# Altium project Soldering_Station_Power_Board.PrjPcb
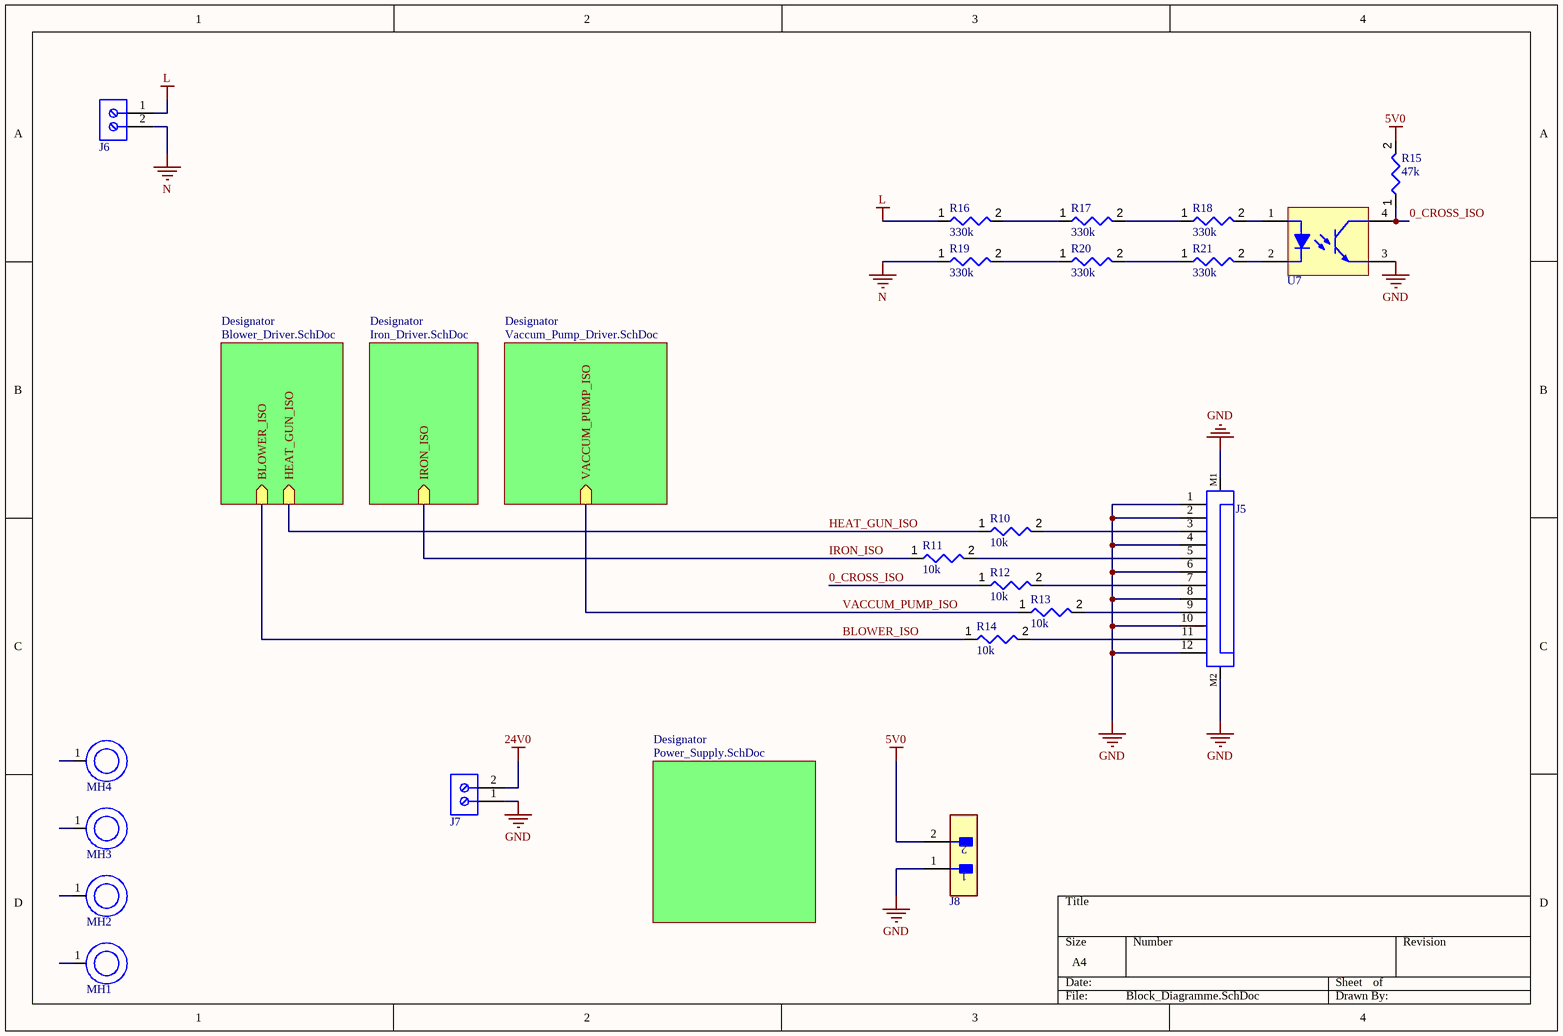
[diagram p0: Block_Diagramme.SchDoc]
5 sheets, 70 parts. Net scope: hierarchical (ports join the sheet entries above them; power ports are global).
Board file: PCB.PcbDoc
Sheets:
  Block_Diagramme.SchDoc
    Designator = Blower_Driver.SchDoc
    Designator = Iron_Driver.SchDoc
    Designator = Vaccum_Pump_Driver.SchDoc
    Designator = Power_Supply.SchDoc

## Sheet Block_Diagramme.SchDoc
size A4; SheetNumber: 1; SheetTotal: 5

### Parts
J5  687112183622  [687112183622]  (value not drawn)
J6  691137710002  [691137710002]  (value not drawn)
J7  691137710002  [691137710002]  (value not drawn)
J8  B2B-XH-A(LF)(SN)  [FP-B2B-XH-A_LF_SN-MFG]  (value not drawn)
MH1  3mm_Mounting_Hole  [Single_3mm_Mounting_Hole]  (value not drawn)
MH2  3mm_Mounting_Hole  [Single_3mm_Mounting_Hole]  (value not drawn)
MH3  3mm_Mounting_Hole  [Single_3mm_Mounting_Hole]  (value not drawn)
MH4  3mm_Mounting_Hole  [Single_3mm_Mounting_Hole]  (value not drawn)
R10  value 10k  [Generic_0603_RES]  (hidden comment: RES-TK_SMD-0603_VIS-CRCW_K_10K_1/10W_1%)
R11  value 10k  [Generic_0603_RES]  (hidden comment: RES-TK_SMD-0603_VIS-CRCW_K_10K_1/10W_1%)
R12  value 10k  [Generic_0603_RES]  (hidden comment: RES-TK_SMD-0603_VIS-CRCW_K_10K_1/10W_1%)
R13  value 10k  [Generic_0603_RES]  (hidden comment: RES-TK_SMD-0603_VIS-CRCW_K_10K_1/10W_1%)
R14  value 10k  [Generic_0603_RES]  (hidden comment: RES-TK_SMD-0603_VIS-CRCW_K_10K_1/10W_1%)
R15  value 47k  [Generic_0603_RES]  (hidden comment: RES-TK_SMD-0603_VIS-CRCW_K_47K_1/10W_1%)
R16  value 330k  [Generic_1206_RES]  (hidden comment: RES-TK_SMD-1206_VIS-CRCW_K_330K_1/4W_1%)
R17  value 330k  [Generic_1206_RES]  (hidden comment: RES-TK_SMD-1206_VIS-CRCW_K_330K_1/4W_1%)
R18  value 330k  [Generic_1206_RES]  (hidden comment: RES-TK_SMD-1206_VIS-CRCW_K_330K_1/4W_1%)
R19  value 330k  [Generic_1206_RES]  (hidden comment: RES-TK_SMD-1206_VIS-CRCW_K_330K_1/4W_1%)
R20  value 330k  [Generic_1206_RES]  (hidden comment: RES-TK_SMD-1206_VIS-CRCW_K_330K_1/4W_1%)
R21  value 330k  [Generic_1206_RES]  (hidden comment: RES-TK_SMD-1206_VIS-CRCW_K_330K_1/4W_1%)
U7  H11A817ASD  [FAIR-H11A817ASD-4_V]  (value not drawn)

### Sub-sheets
Designator = Blower_Driver.SchDoc: BLOWER_ISO (in), HEAT_GUN_ISO (in)
Designator = Iron_Driver.SchDoc: IRON_ISO (in)
Designator = Vaccum_Pump_Driver.SchDoc: VACCUM_PUMP_ISO (in)
Designator = Power_Supply.SchDoc: no entries

### Nets
5V0: J8.2 R15.2
24V0: J7.2
GND: J5.1 J5.2 J5.4 J5.6 J5.8 J5.10 J5.12 J5.M1 J5.M2 J7.1 J8.1 U7.3(EMITTER)
L: J6.1 R16.1
N: J6.2 R19.1
0_CROSS_ISO: R12.1 R15.1 U7.4(COLLECTOR)
BLOWER_ISO: R14.1 ; sheet Designator/BLOWER_ISO
HEAT_GUN_ISO: R10.1 ; sheet Designator/HEAT_GUN_ISO
IRON_ISO: R11.1 ; sheet Designator/IRON_ISO
VACCUM_PUMP_ISO: R13.1 ; sheet Designator/VACCUM_PUMP_ISO
NetJ5_3: J5.3 R10.2
NetJ5_5: J5.5 R11.2
NetJ5_7: J5.7 R12.2
NetJ5_9: J5.9 R13.2
NetJ5_11: J5.11 R14.2
NetR16_2: R16.2 R17.1
NetR17_2: R17.2 R18.1
NetR18_2: R18.2 U7.1(ANODE)
NetR19_2: R19.2 R20.1
NetR20_2: R20.2 R21.1
NetR21_2: R21.2 U7.2(CATHODE)

Not connected (* = marked no-connect by the designer): MH1 1; MH2 1; MH3 1; MH4 1

### Library data of the parts
J5 = CMP-1502-01592-2: NexarPartId: 81848331; Gender: Receptacle; Contact Resistance: 30mΩ; Pitch: 500µm; Current Rating: 400mA; Insulation Resistance: 100MΩ; Operating Supply Voltage: 50V; Min Operating Temperature: -25°C; Packaging: Tape and Reel; Orientation: Horizontal; Number of Pins: 12; Length: 6.6mm; Max Operating Temperature: 85°C; Lead Pitch: 500µm; RoHS: Compliant
J6 J7 = CMP-001-0029-2: 2P Block Terminal; RoHS Compliant: Yes
J8 = CMP-001-0161-1: CONNECTOR HEADER, XH SERIES, 2 POSITION, 2.50MM, Press-Fit Solder, Detent Lock, Natural; Current Rating: 3A; Connector Type: Male Pin; Voltage Rating (AC): 250V; Wire/Cable Gauge: 22AWG; Number of Contacts: 2; Pitch: 2.5mm; Contact Resistance: 20mΩ; Insulation Resistance: 1GΩ; Fastening Type: Detent; REACH SVHC: Yes; Orientation: Straight; Depth: 5.75mm; Width: 6.35mm; Max Operating Temperature: 85°C; Mounting Technology: Through Hole; China RoHS: Compliant; Lead Pitch: 2.5mm; Contact Gender: Male; Contact Material: Copper, Tin; Terminal Pitch: 2.5mm; Termination: Solder; Max Voltage Rating (AC): 250V; Lead Free: Lead Free; Pins: 2; Color: Natural; Lifecycle Status: Production; Max Current Rating: 3A; Height: 7mm; Min Operating Temperature: -25°C; Weight: 28.349523g; Housing Color: White; Number of Rows: 1; Length: 7.4mm; Housing Material: Polyamide; Voltage Rating: 250V; Max Voltage Rating (DC): 250V; Number of Positions: 2; Contact Plating: Tin; RoHS: Compliant
MH1-MH4 = CMP-001-0046-3: 3.2mm, sPad Mounting Hole; Size: 3mm
R10-R14 = CMP-009-00246-1: Fixed Resistor, Metal Glaze/thick Film, 0.1W, 10000ohm, 75V, 1% +/-Tol, 100ppm/Cel, Surface Mount, 0603; Power: 100mW; Mounting Technology: Surface Mount; Pins: 2; Min Operating Temperature: -55°C; Tolerance: 1%; RoHS Compliant: Yes; Max Operating Temperature: 155°C; Case/Package: 0603; Voltage Rating: 75V
R15 = CMP-009-00207-2: Fixed Resistor, Metal Glaze/thick Film, 0.1W, 47000ohm, 75V, 1% +/-Tol, 100ppm/Cel, Surface Mount, 0603; Power: 100mW; Case/Package: 0603; Max Operating Temperature: 155°C; Voltage Rating: 75V; RoHS Compliant: Yes; Min Operating Temperature: -55°C; Tolerance: 1%; Mounting Technology: Surface Mount; Pins: 2
R16-R21 = CMP-009-00015-1: Res Thick Film 1206 330K Ohm 1% 1/4W ±100ppm/°C Molded SMD SMD Paper T/R; Power: 750mW; Voltage Rating: 200V; Max Operating Temperature: 155°C; Case/Package: 1206; Tolerance: 1%; Mounting Technology: Surface Mount; Min Operating Temperature: -55°C; RoHS Compliant: Yes; Pins: 2
U7 = CMP-001-0167-1: OptoCouplers & OptoIsolators Optocoupler SM-DIP4 Phototransistor; Power Dissipation: 200mW; Number of Circuits: 1; Output Current per Channel: 50mA; Fall Time: 18µs; Forward Voltage: 1.5V; Dark Current: 100nA; Isolation Voltage: 5kV; Collector Emitter Breakdown Voltage: 70V; Reverse Breakdown Voltage: 6V; Current Transfer Ratio: 80%; Collector Emitter Saturation Voltage: 200mV; Min Operating Temperature: -55°C; Case/Package: SMD/SMT; RoHS: Compliant; Forward Current: 50mA; Lifecycle Status: Obsolete; Max Power Dissipation: 200mW; Continuous Collector Current: 50mA; Pins: 4; Lead Free: Lead Free; Number of Channels: 1; Rise Time: 18µs; Max Operating Temperature: 100°C; Collector Emitter Voltage (VCEO): 70V; Output Voltage: 70V; Max Collector Current: 50mA; Packaging: Tape and Reel; Number of Elements: 1

## Sheet Blower_Driver.SchDoc
size A4; SheetNumber: 2; SheetTotal: 5
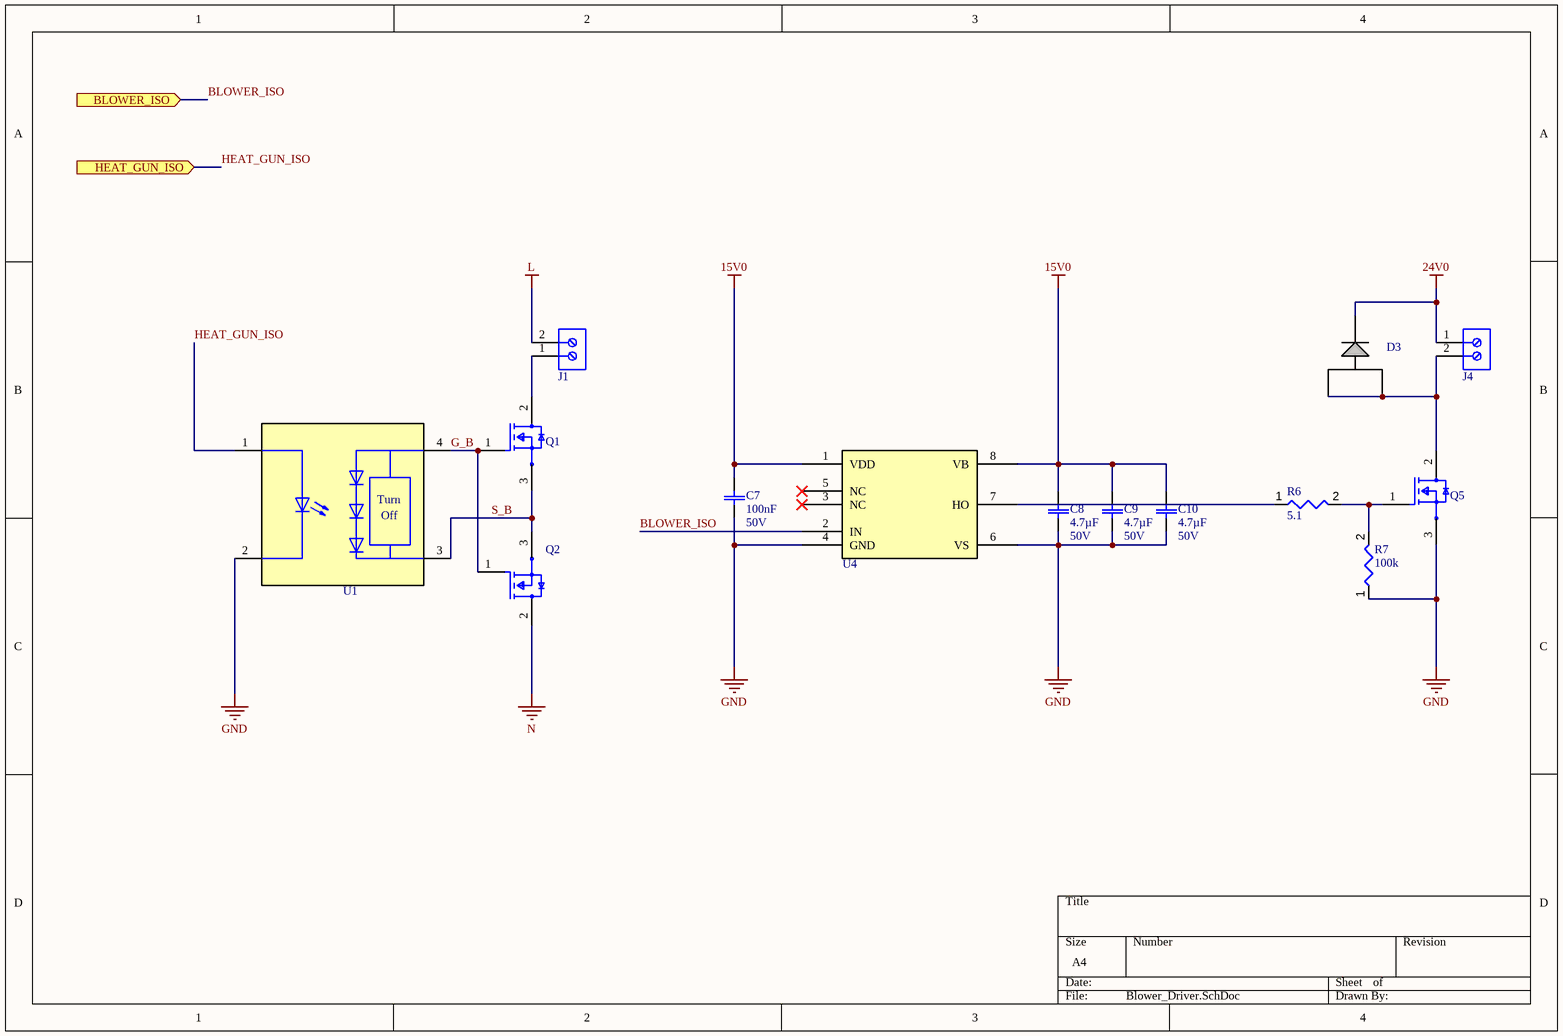
[diagram p1: Blower_Driver.SchDoc]

### Parts
C7  value 100nF  Voltage Rating: 50V  [Generic Ceramic 0603 CAP]  (hidden comment: CAP-MLCC_SMD-0603_MR-GCM_u_0.1uF_50V_10%_X8L)
C8  value 4.7µF  Voltage Rating: 50V  [Generic Ceramic 0805 CAP]  (hidden comment: CAP-MLCC_SMD-0805_TDK-CGA_u_4.7uF_V_10%_X8R)
C9  value 4.7µF  Voltage Rating: 50V  [Generic Ceramic 0805 CAP]  (hidden comment: CAP-MLCC_SMD-0805_TDK-CGA_u_4.7uF_V_10%_X8R)
C10  value 4.7µF  Voltage Rating: 50V  [Generic Ceramic 0805 CAP]  (hidden comment: CAP-MLCC_SMD-0805_TDK-CGA_u_4.7uF_V_10%_X8R)
D3  STPS1045B  [STPS1045B-Footprint-1]  (value not drawn)
J1  691137710002  [691137710002]  (value not drawn)
J4  691137710002  [691137710002]  (value not drawn)
Q1  STD7NM50N  [STD7NM50N-Footprint-1]  (value not drawn)
Q2  STD7NM50N  [STD7NM50N-Footprint-1]  (value not drawn)
Q5  STD7NM50N  [STD7NM50N-Footprint-1]  (value not drawn)
R6  value 5.1  [Generic_0805_RES]  (hidden comment: RES-TK_SMD-0805_VIS-CRCW_R_5.1R_1/10W_1%)
R7  value 100k  [Generic_0805_RES]  (hidden comment: RES-TK_SMD-0805_VIS-CRCW_K_100K_1/8W_1%)
U1  VOM1271T  [VOM1271T-Footprint-1]  (value not drawn)
U4  fan73711  [fan73711-Footprint-1]  (value not drawn)

### Ports
BLOWER_ISO (in, see 1[1B]), HEAT_GUN_ISO (in, see 1[1B])

### Nets
15V0: C7.2 C8.2 C9.2 C10.2 U4.1(VDD) U4.8(VB)
24V0: D3.3 J4.1
GND: C7.1 C8.1 C9.1 C10.1 Q5.3 R7.1 U1.2(C1) U4.4(GND) U4.6(VS)
L: J1.2
N: Q2.2
BLOWER_ISO: U4.2(IN) ; port BLOWER_ISO
G_B: Q1.1 Q2.1 U1.4(A2)
HEAT_GUN_ISO: U1.1(A1) ; port HEAT_GUN_ISO
S_B: Q1.3 Q2.3 U1.3(C2)
NetD3_1: D3.1 D3.2 J4.2 Q5.2
NetJ1_1: J1.1 Q1.2
NetQ5_1: Q5.1 R6.2 R7.2
NetR6_1: R6.1 U4.7(HO)

Not connected (* = marked no-connect by the designer): U4 3(NC)* 5(NC)*

### Notes on the sheet
- (in symbol CMP-001-0179-1) Turn; Off

### Library data of the parts
C7 = CMP-001-00115-11: Ceramic Capacitor, Multilayer, Ceramic, 50V, 10% +Tol, 10% -Tol, X8L, -40/+15% TC, 0.1uF, Surface Mount, 0603; Automotive: AEQ-200; Min Operating Temperature: -55°C; Case/Package: 0603; Mounting Technology: Surface Mount; RoHS Compliant: Yes; Capacitor Type: Ceramic; Pins: 2; Max Operating Temperature: 150°C
C8-C10 = CMP-001-00158-2: Ceramic Capacitor, Multilayer, Ceramic, 50V, 10% +Tol, 10% -Tol, X5R, 15% TC, 4.7uF, Surface Mount, 0805; Tolerance: 10%; Max Operating Temperature: 85°C; Case/Package: 0805; RoHS Compliant: Yes; Automotive: AEQ-Q200; Mounting Technology: Surface Mount; Capacitor Type: Ceramic; Pins: 2; Dielectric: x5r; Min Operating Temperature: -55°C
D3 = CMP-001-0199-1: Rectifier Diode, Schottky, 1 Phase, 1 Element, 10A, 45V V(RRM), Silicon, TO-252AA; Max Reverse Leakage Current: 100µA; Forward Voltage: 570mV; Polarity: Standard; Max Surge Current: 75A; Element Configuration: Common Anode; Number of Elements: 1; Max Junction Temperature (Tj): 175°C; Current Rating: 10A; Radiation Hardening: No; REACH SVHC: No; Min Operating Temperature: -65°C; Lifecycle Status: Production; China RoHS: Non-Compliant; Schedule B: 8541100080, 8541100080; Forward Current: 10A; Max Reverse Voltage (DC): 45V; Voltage Rating (DC): 45V; Output Current: 10A; Pins: 2; Number of Terminals: 2; Max Operating Temperature: 175°C; Max Output current: 10A; Mounting Technology: Surface Mount; Case/Package: DPAK; Max Repetitive Reverse Voltage (Vrrm): 45V; Average Rectified Current: 10A; Width: 6.2mm; Peak Reverse Current: 100µA; Length: 6.6mm; Lead Free: Lead Free; Peak Non-Repetitive Surge Current: 75A; Reverse Standoff Voltage: 45V; Height: 2.4mm; Max Forward Surge Current (Ifsm): 75A; RoHS: Compliant
J1 J4 = CMP-001-0029-2: 2P Block Terminal; RoHS Compliant: Yes
Q1 Q2 Q5 = CMP-001-0178-1: N-channel 500V - 0.70 Ohm - 5A - TO-220 - TO-220FP - Ipak - Dpak; Gate to Source Voltage (Vgs): 25V; Max Power Dissipation: 45W; Turn-Off Delay Time: 40ns; Rise Time: 5ns; Drain to Source Resistance: 780mΩ; Element Configuration: Single; Number of Elements: 1; Input Capacitance: 400pF; Nominal Vgs: 3V; Value: 780mΩ; Fall Time: 9ns; Pins: 3; Min Operating Temperature: -55°C; Mounting Technology: Surface Mount; Max Operating Temperature: 150°C; Packaging: Cut Tape (CT); Drain to Source Breakdown Voltage: 500V; Drain to Source Voltage (Vdss): 500V; Min Breakdown Voltage: 500V; Lead Free: Lead Free; China RoHS: Non-Compliant; Rds On Max: 780mΩ; RoHS: Compliant; Lifecycle Status: Obsolete; Case/Package: TO-252-3; Power Dissipation: 45W; Continuous Drain Current (ID): 5A; Number of Terminals: 2; REACH SVHC: No
R6 = CMP-009-00244-4: Fixed Resistor, Metal Glaze/thick Film, 0.125W, 1ohm, 150V, 1% +/-Tol, 100ppm/Cel, Surface Mount, 0805; Voltage Rating: 75V; Power: 125mW; Pins: 2; Case/Package: 0805; Tolerance: 1%; Min Operating Temperature: -55°C; RoHS Compliant: Yes; Mounting Technology: Surface Mount; Max Operating Temperature: 155°C
R7 = CMP-009-00208-8: Fixed Resistor, Metal Glaze/thick Film, 0.125W, 100000ohm, 150V, 1% +/-Tol, 100ppm/Cel, Surface Mount, 0805; Power: 125mW; RoHS Compliant: Yes; Case/Package: 0805; Max Operating Temperature: 155°C; Mounting Technology: Surface Mount; Tolerance: 1%; Pins: 2; Min Operating Temperature: -55°C; Voltage Rating: 150V
U1 = CMP-001-0179-1: Optocoupler DC-IN 1-CH Linear Photovoltaic DC-OUT 4-Pin SOP T/R; Number of Channels: 1; Max Output current: 7µA; Forward Voltage: 1.4V; Turn-Off Delay Time: 24µs; Max Supply Voltage: 1.6V; Input Current: 50mA; Isolation Voltage: 4.5kV; Turn-On Delay Time: 53µs; Reverse Breakdown Voltage: 5V; Height: 2.42mm; Width: 4.57mm; Height - Seated (Max): 2.42mm; Pins: 4; Number of Elements: 1; Ambient Temperature Range High: 100°C; Length: 4.92mm; Lead Free: Lead Free; Number of Terminals: 4; Mounting Technology: Surface Mount; Radiation Hardening: No; Lifecycle Status: Production; REACH SVHC: Yes; RoHS: Compliant; Max Input Current: 50mA; Number of Circuits: 1; Case/Package: SOP; Terminal Pitch: 2.54mm; Contact Plating: Tin; Max Operating Temperature: 100°C; Schedule B: 8541408000, 8541408000; Min Operating Temperature: -40°C; Forward Current: 50mA
U4 = CMP-001-0175-1: Tape & Reel (TR) FAN73711 High-Side 2009 gate driver 25ns 125C 4A 4A 625mW; Manufacturer Lifecycle Status: ACTIVE; Output Voltage: 1.2V; Number of Outputs: 1; Max Supply Current: 100µA; Turn-Off Delay Time: 150ns; Min Supply Voltage: 10V; Max Supply Voltage: 20V; Operating Supply Voltage: 15V; Nominal Supply Current: 35µA; Fall Time: 15ns; Max Junction Temperature (Tj): 150°C; Max Output current: 4A; Max Operating Temperature: 125°C; Power Dissipation: 625mW; REACH SVHC: Yes; Terminal Pitch: 1.27mm; Rise Time: 25ns; Length: 4.92mm; Radiation Hardening: No; Width: 3.95mm; Weight: 143mg; Turn-On Delay Time: 150ns; Packaging: Cut Tape; Max Power Dissipation: 625mW; Pins: 8; Number of Circuits: 1; Lifecycle Status: Production; Schedule B: 8542310000, 8542310000; Mounting Technology: Surface Mount; China RoHS: Compliant; RoHS: Compliant; Output Current: 4A; Lead Free: Lead Free; Number of Drivers: 1; Min Operating Temperature: -40°C; Propagation Delay: 150ns; Height - Seated (Max): 1.8mm; Number of Channels: 1; Height: 1.85mm; Ambient Temperature Range High: 125°C; Case/Package: SOP; Number of Terminals: 8

## Sheet Iron_Driver.SchDoc
size A4; SheetNumber: 3; SheetTotal: 5
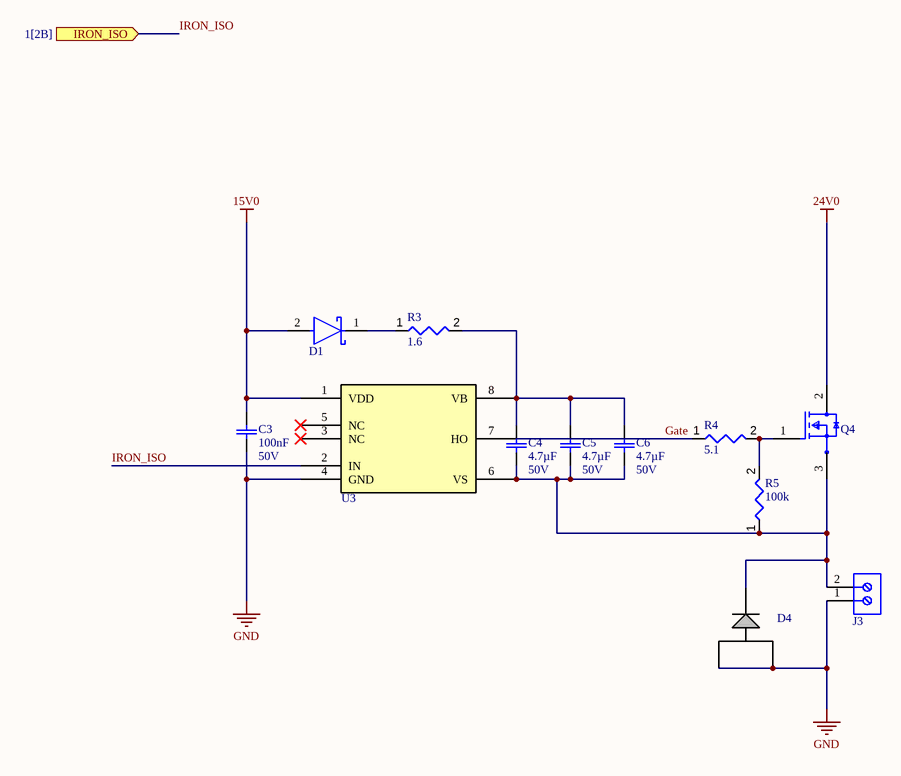
[diagram p2: Iron_Driver.SchDoc]

### Parts
C3  value 100nF  Voltage Rating: 50V  [Generic Ceramic 0603 CAP]  (hidden comment: CAP-MLCC_SMD-0603_MR-GCM_u_0.1uF_50V_10%_X8L)
C4  value 4.7µF  Voltage Rating: 50V  [Generic Ceramic 0805 CAP]  (hidden comment: CAP-MLCC_SMD-0805_TDK-CGA_u_4.7uF_V_10%_X8R)
C5  value 4.7µF  Voltage Rating: 50V  [Generic Ceramic 0805 CAP]  (hidden comment: CAP-MLCC_SMD-0805_TDK-CGA_u_4.7uF_V_10%_X8R)
C6  value 4.7µF  Voltage Rating: 50V  [Generic Ceramic 0805 CAP]  (hidden comment: CAP-MLCC_SMD-0805_TDK-CGA_u_4.7uF_V_10%_X8R)
D1  MBRA340T3G  [ONSC-SMA-2-403D-02_F_V]  (value not drawn)
D4  STPS1045B  [STPS1045B-Footprint-1]  (value not drawn)
J3  691137710002  [691137710002]  (value not drawn)
Q4  STD7NM50N  [STD7NM50N-Footprint-1]  (value not drawn)
R3  value 1.6  [Generic_1206_RES]  (hidden comment: RES-TK_SMD-1206_VIS-CRCW_R_1.6R_3/4W_1%)
R4  value 5.1  [Generic_0805_RES]  (hidden comment: RES-TK_SMD-0805_VIS-CRCW_R_5.1R_1/10W_1%)
R5  value 100k  [Generic_0805_RES]  (hidden comment: RES-TK_SMD-0805_VIS-CRCW_K_100K_1/8W_1%)
U3  fan73711  [fan73711-Footprint-1]  (value not drawn)

### Ports
IRON_ISO (in, see 1[2B])

### Nets
15V0: C3.2 D1.2(A) U3.1(VDD)
24V0: Q4.2
GND: C3.1 D4.1 D4.2 J3.1 U3.4(GND)
Gate: R4.1 U3.7(HO)
IRON_ISO: U3.2(IN) ; port IRON_ISO
NetC4_1: C4.1 C5.1 C6.1 D4.3 J3.2 Q4.3 R5.1 U3.6(VS)
NetC4_2: C4.2 C5.2 C6.2 R3.2 U3.8(VB)
NetD1_1: D1.1(C) R3.1
NetQ4_1: Q4.1 R4.2 R5.2

Not connected (* = marked no-connect by the designer): U3 3(NC)* 5(NC)*

### Library data of the parts
C3 = CMP-001-00115-11: as C7 on sheet Blower_Driver; Automotive: AEQ-200; Min Operating Temperature: -55°C; Case/Package: 0603; Mounting Technology: Surface Mount; RoHS Compliant: Yes; Capacitor Type: Ceramic; Pins: 2; Max Operating Temperature: 150°C
C4-C6 = CMP-001-00158-2: as C8 on sheet Blower_Driver; Tolerance: 10%; Max Operating Temperature: 85°C; Case/Package: 0805; RoHS Compliant: Yes; Automotive: AEQ-Q200; Mounting Technology: Surface Mount; Capacitor Type: Ceramic; Pins: 2; Dielectric: x5r; Min Operating Temperature: -55°C
D1 = CMP-001-0146-1: Diode, Schottky Barrier, Vr 40V, If 3A, Pkg SMA, Vf 0.45V, Tj +150degc, Cs 100A, Ir 15mA; Manufacturer Lifecycle Status: ACTIVE; Max Junction Temperature (Tj): 150°C; Number of Elements: 1; Forward Voltage: 450mV; Polarity: Standard; Peak Reverse Current: 300µA; Element Configuration: Single; REACH SVHC: No; Number of Terminals: 2; Width: 2.6mm; Min Operating Temperature: -55°C; Voltage Rating (DC): 40V; Reverse Standoff Voltage: 40V; Max Repetitive Reverse Voltage (Vrrm): 40V; Lifecycle Status: Production; Reverse Voltage: 40V; Output Current: 3A; Pins: 2; Lead Free: Lead Free; Max Reverse Voltage (DC): 40V; Max Forward Surge Current (Ifsm): 100A; Forward Current: 3A; Current Rating: 3A; Length: 4.32mm; Average Rectified Current: 3A; Radiation Hardening: No; Packaging: Tape and Reel; Max Operating Temperature: 150°C; Halogen Free: Halogen Free; China RoHS: Non-Compliant; Case/Package: SMA; RoHS: Compliant; Height: 2.2mm; Schedule B: 8541100080; Max Output current: 3A; Peak Non-Repetitive Surge Current: 100A
D4 = CMP-001-0199-1: as D3 on sheet Blower_Driver; Current Rating: 10A; Radiation Hardening: No; REACH SVHC: No; Min Operating Temperature: -65°C; Lifecycle Status: Production; China RoHS: Non-Compliant; Schedule B: 8541100080, 8541100080; Forward Current: 10A; Max Reverse Voltage (DC): 45V; Voltage Rating (DC): 45V; Output Current: 10A; Pins: 2; Number of Terminals: 2; Max Operating Temperature: 175°C; Max Output current: 10A; Mounting Technology: Surface Mount; Case/Package: DPAK; Max Repetitive Reverse Voltage (Vrrm): 45V; Average Rectified Current: 10A; Width: 6.2mm; Peak Reverse Current: 100µA; Length: 6.6mm; Lead Free: Lead Free; Peak Non-Repetitive Surge Current: 75A; Reverse Standoff Voltage: 45V; Height: 2.4mm; Max Forward Surge Current (Ifsm): 75A; RoHS: Compliant
J3 = CMP-001-0029-2: 2P Block Terminal; RoHS Compliant: Yes
Q4 = CMP-001-0178-1: as Q1 on sheet Blower_Driver; Pins: 3; Min Operating Temperature: -55°C; Mounting Technology: Surface Mount; Max Operating Temperature: 150°C; Packaging: Cut Tape (CT); Drain to Source Breakdown Voltage: 500V; Drain to Source Voltage (Vdss): 500V; Min Breakdown Voltage: 500V; Lead Free: Lead Free; China RoHS: Non-Compliant; Rds On Max: 780mΩ; RoHS: Compliant; Lifecycle Status: Obsolete; Case/Package: TO-252-3; Power Dissipation: 45W; Continuous Drain Current (ID): 5A; Number of Terminals: 2; REACH SVHC: No
R3 = CMP-009-00251-1: Fixed Resistor, Metal Glaze/thick Film, 0.75W, 1.6ohm, 200V, 1% +/-Tol, 100ppm/Cel, Surface Mount, 1206; Power: 750mW; Pins: 2; Max Operating Temperature: 155°C; Mounting Technology: Surface Mount; Tolerance: 1%; Min Operating Temperature: -55°C; RoHS Compliant: Yes; Case/Package: 1206
R4 = CMP-009-00244-4: as R6 on sheet Blower_Driver; Pins: 2; Case/Package: 0805; Tolerance: 1%; Min Operating Temperature: -55°C; RoHS Compliant: Yes; Mounting Technology: Surface Mount; Max Operating Temperature: 155°C
R5 = CMP-009-00208-8: as R7 on sheet Blower_Driver; RoHS Compliant: Yes; Case/Package: 0805; Max Operating Temperature: 155°C; Mounting Technology: Surface Mount; Tolerance: 1%; Pins: 2; Min Operating Temperature: -55°C; Voltage Rating: 150V
U3 = CMP-001-0175-1: as U4 on sheet Blower_Driver; Max Output current: 4A; Max Operating Temperature: 125°C; Power Dissipation: 625mW; REACH SVHC: Yes; Terminal Pitch: 1.27mm; Rise Time: 25ns; Length: 4.92mm; Radiation Hardening: No; Width: 3.95mm; Weight: 143mg; Turn-On Delay Time: 150ns; Packaging: Cut Tape; Max Power Dissipation: 625mW; Pins: 8; Number of Circuits: 1; Lifecycle Status: Production; Schedule B: 8542310000, 8542310000; Mounting Technology: Surface Mount; China RoHS: Compliant; RoHS: Compliant; Output Current: 4A; Lead Free: Lead Free; Number of Drivers: 1; Min Operating Temperature: -40°C; Propagation Delay: 150ns; Height - Seated (Max): 1.8mm; Number of Channels: 1; Height: 1.85mm; Ambient Temperature Range High: 125°C; Case/Package: SOP; Number of Terminals: 8

## Sheet Vaccum_Pump_Driver.SchDoc
size A4; SheetNumber: 4; SheetTotal: 5
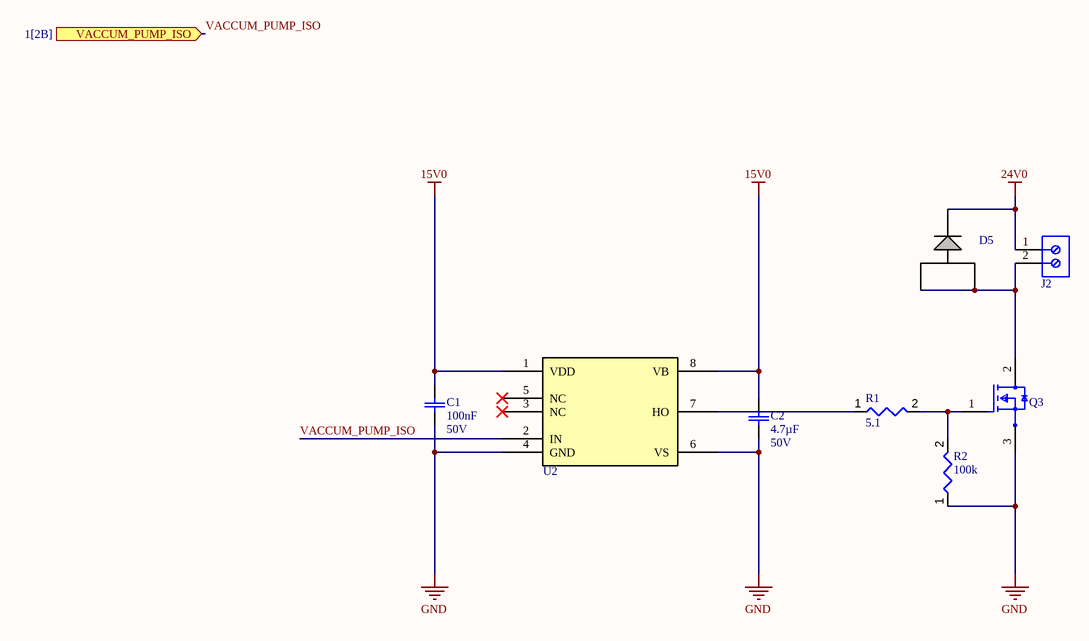
[diagram p3: Vaccum_Pump_Driver.SchDoc]

### Parts
C1  value 100nF  Voltage Rating: 50V  [Generic Ceramic 0603 CAP]  (hidden comment: CAP-MLCC_SMD-0603_MR-GCM_u_0.1uF_50V_10%_X8L)
C2  value 4.7µF  Voltage Rating: 50V  [Generic Ceramic 0805 CAP]  (hidden comment: CAP-MLCC_SMD-0805_TDK-CGA_u_4.7uF_V_10%_X8R)
D5  STPS1045B  [STPS1045B-Footprint-1]  (value not drawn)
J2  691137710002  [691137710002]  (value not drawn)
Q3  STD7NM50N  [STD7NM50N-Footprint-1]  (value not drawn)
R1  value 5.1  [Generic_0805_RES]  (hidden comment: RES-TK_SMD-0805_VIS-CRCW_R_5.1R_1/10W_1%)
R2  value 100k  [Generic_0805_RES]  (hidden comment: RES-TK_SMD-0805_VIS-CRCW_K_100K_1/8W_1%)
U2  fan73711  [fan73711-Footprint-1]  (value not drawn)

### Ports
VACCUM_PUMP_ISO (in, see 1[2B])

### Nets
15V0: C1.2 C2.2 U2.1(VDD) U2.8(VB)
24V0: D5.3 J2.1
GND: C1.1 C2.1 Q3.3 R2.1 U2.4(GND) U2.6(VS)
VACCUM_PUMP_ISO: U2.2(IN) ; port VACCUM_PUMP_ISO
NetD5_1: D5.1 D5.2 J2.2 Q3.2
NetQ3_1: Q3.1 R1.2 R2.2
NetR1_1: R1.1 U2.7(HO)

Not connected (* = marked no-connect by the designer): U2 3(NC)* 5(NC)*

### Library data of the parts
C1 = CMP-001-00115-11: as C7 on sheet Blower_Driver; Automotive: AEQ-200; Min Operating Temperature: -55°C; Case/Package: 0603; Mounting Technology: Surface Mount; RoHS Compliant: Yes; Capacitor Type: Ceramic; Pins: 2; Max Operating Temperature: 150°C
C2 = CMP-001-00158-2: as C8 on sheet Blower_Driver; Tolerance: 10%; Max Operating Temperature: 85°C; Case/Package: 0805; RoHS Compliant: Yes; Automotive: AEQ-Q200; Mounting Technology: Surface Mount; Capacitor Type: Ceramic; Pins: 2; Dielectric: x5r; Min Operating Temperature: -55°C
D5 = CMP-001-0199-1: as D3 on sheet Blower_Driver; Current Rating: 10A; Radiation Hardening: No; REACH SVHC: No; Min Operating Temperature: -65°C; Lifecycle Status: Production; China RoHS: Non-Compliant; Schedule B: 8541100080, 8541100080; Forward Current: 10A; Max Reverse Voltage (DC): 45V; Voltage Rating (DC): 45V; Output Current: 10A; Pins: 2; Number of Terminals: 2; Max Operating Temperature: 175°C; Max Output current: 10A; Mounting Technology: Surface Mount; Case/Package: DPAK; Max Repetitive Reverse Voltage (Vrrm): 45V; Average Rectified Current: 10A; Width: 6.2mm; Peak Reverse Current: 100µA; Length: 6.6mm; Lead Free: Lead Free; Peak Non-Repetitive Surge Current: 75A; Reverse Standoff Voltage: 45V; Height: 2.4mm; Max Forward Surge Current (Ifsm): 75A; RoHS: Compliant
J2 = CMP-001-0029-2: 2P Block Terminal; RoHS Compliant: Yes
Q3 = CMP-001-0178-1: as Q1 on sheet Blower_Driver; Pins: 3; Min Operating Temperature: -55°C; Mounting Technology: Surface Mount; Max Operating Temperature: 150°C; Packaging: Cut Tape (CT); Drain to Source Breakdown Voltage: 500V; Drain to Source Voltage (Vdss): 500V; Min Breakdown Voltage: 500V; Lead Free: Lead Free; China RoHS: Non-Compliant; Rds On Max: 780mΩ; RoHS: Compliant; Lifecycle Status: Obsolete; Case/Package: TO-252-3; Power Dissipation: 45W; Continuous Drain Current (ID): 5A; Number of Terminals: 2; REACH SVHC: No
R1 = CMP-009-00244-4: as R6 on sheet Blower_Driver; Pins: 2; Case/Package: 0805; Tolerance: 1%; Min Operating Temperature: -55°C; RoHS Compliant: Yes; Mounting Technology: Surface Mount; Max Operating Temperature: 155°C
R2 = CMP-009-00208-8: as R7 on sheet Blower_Driver; RoHS Compliant: Yes; Case/Package: 0805; Max Operating Temperature: 155°C; Mounting Technology: Surface Mount; Tolerance: 1%; Pins: 2; Min Operating Temperature: -55°C; Voltage Rating: 150V
U2 = CMP-001-0175-1: as U4 on sheet Blower_Driver; Max Output current: 4A; Max Operating Temperature: 125°C; Power Dissipation: 625mW; REACH SVHC: Yes; Terminal Pitch: 1.27mm; Rise Time: 25ns; Length: 4.92mm; Radiation Hardening: No; Width: 3.95mm; Weight: 143mg; Turn-On Delay Time: 150ns; Packaging: Cut Tape; Max Power Dissipation: 625mW; Pins: 8; Number of Circuits: 1; Lifecycle Status: Production; Schedule B: 8542310000, 8542310000; Mounting Technology: Surface Mount; China RoHS: Compliant; RoHS: Compliant; Output Current: 4A; Lead Free: Lead Free; Number of Drivers: 1; Min Operating Temperature: -40°C; Propagation Delay: 150ns; Height - Seated (Max): 1.8mm; Number of Channels: 1; Height: 1.85mm; Ambient Temperature Range High: 125°C; Case/Package: SOP; Number of Terminals: 8

## Sheet Power_Supply.SchDoc
size A4; SheetNumber: 5; SheetTotal: 5
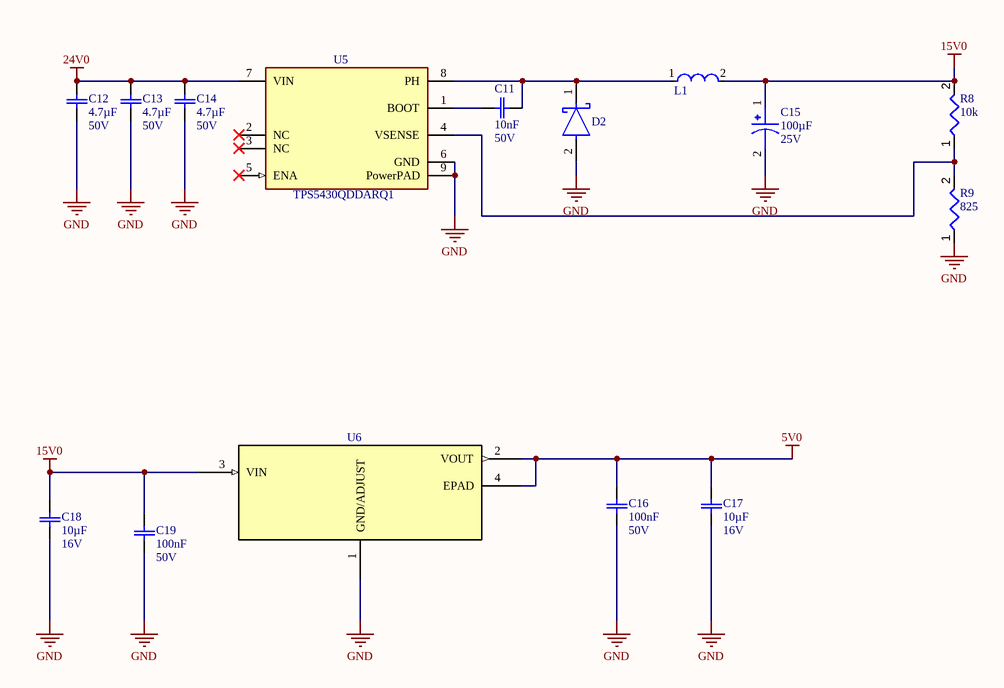
[diagram p4: Power_Supply.SchDoc]

### Parts
C11  value 10nF  Voltage Rating: 50V  [Generic Ceramic 0603 CAP]  (hidden comment: CAP-MLCC_SMD-0603_MR-GCM_n_10nF_50V_10%_COG)
C12  value 4.7µF  Voltage Rating: 50V  [Generic Ceramic 0805 CAP]  (hidden comment: CAP-MLCC_SMD-0805_TDK-CGA_u_4.7uF_V_10%_X8R)
C13  value 4.7µF  Voltage Rating: 50V  [Generic Ceramic 0805 CAP]  (hidden comment: CAP-MLCC_SMD-0805_TDK-CGA_u_4.7uF_V_10%_X8R)
C14  value 4.7µF  Voltage Rating: 50V  [Generic Ceramic 0805 CAP]  (hidden comment: CAP-MLCC_SMD-0805_TDK-CGA_u_4.7uF_V_10%_X8R)
C15  value 100µF  Voltage Rating: 25V  [FP-FKE-MFG]  (hidden comment: CAP_ELEC_SMD_PNS__EEE_u_100uF_25V_20%)
C16  value 100nF  Voltage Rating: 50V  [Generic Ceramic 0603 CAP]  (hidden comment: CAP-MLCC_SMD-0603_MR-GCM_u_0.1uF_50V_10%_X8L)
C17  value 10µF  Voltage Rating: 16V  [Generic Ceramic 0805 CAP]  (hidden comment: CAP-MLCC_SMD-0805_TDK-CGA_u_10uF_16V_20%_X7S)
C18  value 10µF  Voltage Rating: 16V  [Generic Ceramic 0805 CAP]  (hidden comment: CAP-MLCC_SMD-0805_TDK-CGA_u_10uF_16V_20%_X7S)
C19  value 100nF  Voltage Rating: 50V  [Generic Ceramic 0603 CAP]  (hidden comment: CAP-MLCC_SMD-0603_MR-GCM_u_0.1uF_50V_10%_X8L)
D2  MBRA340T3G  [ONSC-SMA-2-403D-02_F_V]  (value not drawn)
L1  SRR1260-150M  [FP-SRR1260-MFG]  (value not drawn)
R8  value 10k  [Generic_0603_RES]  (hidden comment: RES-TK_SMD-0603_VIS-CRCW_K_10K_1/10W_1%)
R9  value 825  [Generic_0603_RES]  (hidden comment: RES-TK_SMD-0603_VIS-CRCW_R_825R_1/10W_1%)
U5  TPS5430QDDARQ1  [FP-DDA0008J-IPC_B]
U6  AMS1117-5.0  [AMS1117-3.3-Footprint-1]  (value not drawn)

### Nets
5V0: C16.2 C17.2 U6.2(VOUT) U6.4(EPAD)
15V0: C15.1 C18.2 C19.2 L1.2 R8.2 U6.3(VIN)
24V0: C12.2 C13.2 C14.2 U5.7(VIN)
GND: C12.1 C13.1 C14.1 C15.2 C16.1 C17.1 C18.1 C19.1 D2.2(A) R9.1 U5.6(GND) U5.9(PowerPAD) U6.1(GND/ADJUST)
NetC11_1: C11.1 D2.1(C) L1.1 U5.8(PH)
NetC11_2: C11.2 U5.1(BOOT)
NetR8_1: R8.1 R9.2 U5.4(VSENSE)

Not connected (* = marked no-connect by the designer): U5 2(NC)* 3(NC)* 5(ENA)*

### Library data of the parts
C11 = CMP-001-00163-2: Ceramic Capacitor, Multilayer, Ceramic, 50V, 5% +Tol, 5% -Tol, C0G, 30ppm/Cel TC, 0.01uF, Surface Mount, 0603; Dielectric: COG; Max Operating Temperature: 125°C; Min Operating Temperature: -55°C; Mounting Technology: Surface Mount; Automotive: AEQ-200; Case/Package: 0603; RoHS Compliant: Yes; Capacitor Type: Ceramic; Pins: 2
C12-C14 = CMP-001-00158-2: as C8 on sheet Blower_Driver; Tolerance: 10%; Max Operating Temperature: 85°C; Case/Package: 0805; RoHS Compliant: Yes; Automotive: AEQ-Q200; Mounting Technology: Surface Mount; Capacitor Type: Ceramic; Pins: 2; Dielectric: x5r; Min Operating Temperature: -55°C
C15 = CMP-001-00185-2: Aluminum Electrolytic Capacitor, Polarized, Aluminum (wet), 25V, 20% +Tol, 20% -Tol, 100uF, Surface Mount, 3333; Manufacturer Part Number: EEE-FK1H101GP; Ripple Current: 225mA; Capacitor Type: Aluminium; Case/Package: 3333; Min Operating Temperature: -55°C; Mounting Technology: Surface Mount; RoHS Compliant: Yes; Pins: 2; Max Operating Temperature: 105°C
C16 C19 = CMP-001-00115-11: as C7 on sheet Blower_Driver; Automotive: AEQ-200; Min Operating Temperature: -55°C; Case/Package: 0603; Mounting Technology: Surface Mount; RoHS Compliant: Yes; Capacitor Type: Ceramic; Pins: 2; Max Operating Temperature: 150°C
C17 C18 = CMP-001-00173-2: Ceramic Capacitor, Multilayer, Ceramic, 16V, 20% +Tol, 20% -Tol, X7S, 22% TC, 10uF, Surface Mount, 0805; RoHS Compliant: Yes; Capacitor Type: Ceramic; Tolerance: 20%; Pins: 2; Mounting Technology: SMD; Case/Package: 0805; Automotive: AEQ-Q200; Dielectric: X7S
D2 = CMP-001-0146-1: as D1 on sheet Iron_Driver; REACH SVHC: No; Number of Terminals: 2; Width: 2.6mm; Min Operating Temperature: -55°C; Voltage Rating (DC): 40V; Reverse Standoff Voltage: 40V; Max Repetitive Reverse Voltage (Vrrm): 40V; Lifecycle Status: Production; Reverse Voltage: 40V; Output Current: 3A; Pins: 2; Lead Free: Lead Free; Max Reverse Voltage (DC): 40V; Max Forward Surge Current (Ifsm): 100A; Forward Current: 3A; Current Rating: 3A; Length: 4.32mm; Average Rectified Current: 3A; Radiation Hardening: No; Packaging: Tape and Reel; Max Operating Temperature: 150°C; Halogen Free: Halogen Free; China RoHS: Non-Compliant; Case/Package: SMA; RoHS: Compliant; Height: 2.2mm; Schedule B: 8541100080; Max Output current: 3A; Peak Non-Repetitive Surge Current: 100A
L1 = CMP-2000-07146-2: FIXED IND 15UH 5A 27 MOHM SMD; Q Factor: 25; Sample Rate (Hz): 100kHz; Resistance: 27MR; Material: Steel; Inductance Tolerance: 20%; Frequency: 17.6MHz; Saturation Current: 4.6A; Core Material: Ferrite; Shielding: Shielded; Series: SRR1260; Termination: SMD/SMT; Packaging: Tape and Reel; RoHS Compliant: Yes; Height - Seated (Max): 0.256inch; Depth: 12.8mm; Case/Package: 1260; Inductance: 15uH; Height: 6mm; Number of Pins: 2; Mount: Surface Mount; Min Operating Temperature: -40°C; Test Frequency: 100kHz; Length: 12.5mm; Self Resonant Frequency: 17.6MHz; Current Rating: 5A; Tolerance: 20%; RMS Current (Irms): 5A; REACH SVHC: No SVHC; Resistor Type: Wirewound; DC Resistance (DCR): 27mR; Width: 12.5mm; Package Quantity: 600; DC Current: 5A; Max DC Current: 5A; Max Operating Temperature: 125°C; Military Standard: Not
R8 = CMP-009-00231-2: Fixed Resistor, Metal Glaze/thick Film, 0.1W, 10000ohm, 75V, 1% +/-Tol, 100ppm/Cel, Surface Mount, 0603; Power: 100mW; Min Operating Temperature: -55°C; Case/Package: 0603; Max Operating Temperature: 155°C; RoHS Compliant: Yes; Voltage Rating: 75V; Tolerance: 1%; Pins: 2; Mounting Technology: Surface Mount
R9 = CMP-009-00203-6: Fixed Resistor, Metal Glaze/thick Film, 0.1W, 825ohm, 75V, 1% +/-Tol, 100ppm/Cel, Surface Mount, 0603; Power: 100mW; Case/Package: 0603; Min Operating Temperature: -55°C; Voltage Rating: 75V; Tolerance: 1%; Mounting Technology: Surface Mount; Pins: 2; Max Operating Temperature: 155°C; RoHS Compliant: Yes
U5 = CMP-001-0169-1: Automotive 5.5V to 36V, 500kHz Fixed Frequency 3A Buck Converter 8-SO PowerPAD -40 to 125; Manufacturer Lifecycle Status: ACTIVE; Output Voltage: 1.221V; Output Type: Adjustable; Quiescent Current: 3mA; Number of Outputs: 1; Max Duty Cycle: 89%; Efficiency: 95%; Max Output Voltage: 31V; Min Output Voltage: 1.22V; Max Junction Temperature (Tj): 125°C; Synchronous Rectifier: No; Pins: 8; Length: 4.89mm; REACH SVHC: No; Height: 1.7mm; Mounting Technology: Surface Mount; Radiation Hardening: No; Thickness: 1.48mm; Width: 3.9mm; Output Current: 3A; Lead Free: Lead Free; Min Input Voltage: 5.5V; Switching Frequency: 500kHz; Nominal Supply Current: 3mA; Topology: Buck; Min Supply Voltage: 5.5V; Operating Supply Voltage: 36V; RoHS: Compliant; Max Supply Voltage: 36V; Max Output current: 3A; Weight: 70.590313mg; Min Operating Temperature: -40°C; Max Operating Temperature: 125°C; Lifecycle Status: Production
U6 = CMP-001-0174-1: LDO Regulator Pos 5V 1A 4-Pin(3+Tab) SOT-223 / 1A LOW DROPOUT VOLTAGE REGULATOR; Max Power Dissipation: 1.2W; Max Junction Temperature (Tj): 125°C; Max Supply Voltage: 15V; Dropout Voltage: 1.1V; Number of Outputs: 1; Nominal Supply Current: 5mA; Min Operating Temperature: -40°C; RoHS: Compliant; REACH SVHC: Yes; Case/Package: SOT-223; Output Current: 1A; Pins: 2; Max Operating Temperature: 125°C; Height: 1.8mm; Output Voltage: 5V

## Nets that join several sheets
5V0: Block_Diagramme (J8.2 R15.2), Power_Supply (C16.2 C17.2 U6.2 U6.4)
15V0: Blower_Driver (6 pins), Iron_Driver (C3.2 D1.2 U3.1), Vaccum_Pump_Driver (C1.2 C2.2 U2.1 U2.8), Power_Supply (6 pins)
24V0: Block_Diagramme (J7.2), Blower_Driver (D3.3 J4.1), Iron_Driver (Q4.2), Vaccum_Pump_Driver (D5.3 J2.1), Power_Supply (C12.2 C13.2 C14.2 U5.7)
GND: Block_Diagramme (12 pins), Blower_Driver (9 pins), Iron_Driver (5 pins), Vaccum_Pump_Driver (6 pins), Power_Supply (13 pins)
L: Block_Diagramme (J6.1 R16.1), Blower_Driver (J1.2)
N: Block_Diagramme (J6.2 R19.1), Blower_Driver (Q2.2)
BLOWER_ISO: Block_Diagramme (R14.1), Blower_Driver (U4.2)
HEAT_GUN_ISO: Block_Diagramme (R10.1), Blower_Driver (U1.1)
IRON_ISO: Block_Diagramme (R11.1), Iron_Driver (U3.2)
VACCUM_PUMP_ISO: Block_Diagramme (R13.1), Vaccum_Pump_Driver (U2.2)